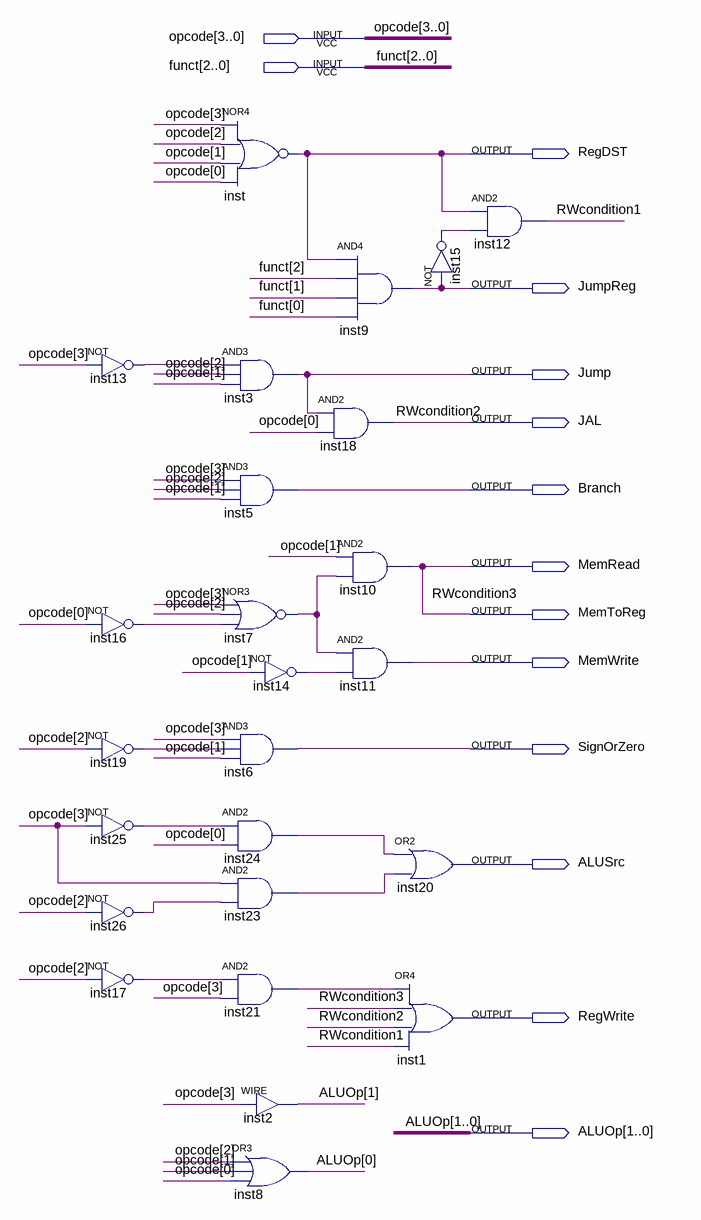
[diagram p0: schematic sheet]
// Quartus schematic control.bdf as structural Verilog: 25 symbols, 14 pins
module control (
  input  [3:0] opcode,
  input  [2:0] funct,
  output RegDST,
  output JumpReg,
  output Jump,
  output JAL,
  output Branch,
  output MemRead,
  output MemToReg,
  output MemWrite,
  output SignOrZero,
  output ALUSrc,
  output RegWrite,
  output [1:0] ALUOp
);

  wire inst7_out, inst13_out, inst14_out, inst15_out, inst16_out, inst17_out, inst19_out, inst21_out,
       inst23_out, inst24_out, inst25_out, inst26_out, RWcondition1;

  not inst13 (inst13_out, opcode[3]);
  not inst16 (inst16_out, opcode[0]);
  not inst19 (inst19_out, opcode[2]);
  not inst25 (inst25_out, opcode[3]);
  not inst26 (inst26_out, opcode[2]);
  not inst17 (inst17_out, opcode[2]);
  nor inst (RegDST, opcode[3], opcode[2], opcode[1], opcode[0]);
  and inst3 (Jump, inst13_out, opcode[2], opcode[1]);
  and inst5 (Branch, opcode[3], opcode[2], opcode[1]);
  nor inst7 (inst7_out, opcode[3], opcode[2], inst16_out);
  not inst14 (inst14_out, opcode[1]);
  and inst6 (SignOrZero, opcode[3], inst19_out, opcode[1]);
  and inst24 (inst24_out, inst25_out, opcode[0]);
  and inst23 (inst23_out, opcode[3], inst26_out);
  and inst21 (inst21_out, inst17_out, opcode[3]);
  assign ALUOp[1] = opcode[3];  // WIRE inst2
  or inst8 (ALUOp[0], opcode[2], opcode[1], opcode[0]);
  and inst9 (JumpReg, RegDST, funct[2], funct[1], funct[0]);
  and inst18 (JAL, Jump, opcode[0]);
  and inst10 (MemRead, opcode[1], inst7_out);
  and inst11 (MemWrite, inst7_out, inst14_out);
  not inst15 (inst15_out, JumpReg);
  or inst20 (ALUSrc, inst24_out, inst23_out);
  or inst1 (RegWrite, inst21_out, MemRead, JAL, RWcondition1);
  and inst12 (RWcondition1, RegDST, inst15_out);

  assign MemToReg = MemRead;

  // Other names for the same wires on the sheet: RWcondition2 = JAL; RWcondition3 = MemRead
endmodule
